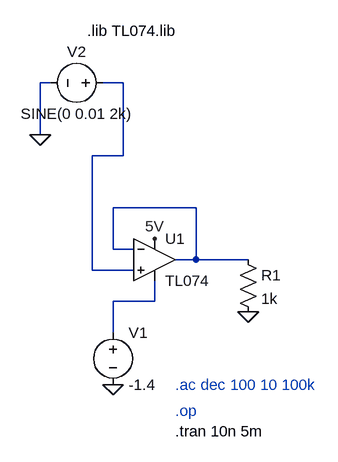
[diagram p0: schematic piezo_buffer.asc]
piezo_buffer.asc, the LTspice schematic file:
Version 4
SHEET 1 880 1696
WIRE -336 1104 -352 1104
WIRE -224 1104 -256 1104
WIRE -352 1184 -352 1104
WIRE -224 1216 -224 1104
WIRE -224 1216 -272 1216
WIRE -112 1296 -240 1296
WIRE -240 1360 -240 1296
WIRE -208 1360 -240 1360
WIRE -112 1376 -112 1296
WIRE -112 1376 -144 1376
WIRE -32 1376 -112 1376
WIRE -272 1392 -272 1216
WIRE -208 1392 -272 1392
WIRE -176 1440 -176 1408
WIRE -176 1440 -240 1440
WIRE -240 1488 -240 1440
FLAG -176 1344 5V
FLAG -32 1456 0
FLAG -352 1184 0
FLAG -240 1568 0
SYMBOL OpAmps/opamp2 -176 1312 R0
SYMATTR InstName U1
SYMATTR Value TL074
SYMBOL voltage -240 1104 R90
WINDOW 0 -32 56 VBottom 2
WINDOW 3 32 56 VTop 2
SYMATTR InstName V2
SYMATTR Value SINE(0 0.01 2k)
SYMBOL Res -48 1360 R0
SYMATTR InstName R1
SYMATTR Value 1k
SYMBOL voltage -240 1472 R0
SYMATTR InstName V1
SYMATTR Value -1.4
TEXT -144 1568 Left 2 ;.ac dec 100 10 100k
TEXT -144 1608 Left 2 ;.op
TEXT -144 1640 Left 2 !.tran 10n 5m
TEXT -280 1024 Left 2 !.lib TL074.lib

The netlist it stands for:
* piezo_buffer.asc
XU1 N001 N002 5V N003 N002 TL074  ; pins In+ In- V+ V- OUT
V2 N001 0 SINE(0 0.01 2k)
R1 N002 0 1k
V1 N003 0 -1.4
* .ac dec 100 10 100k
* .op
.tran 10n 5m
.lib TL074.lib
.backanno
.end